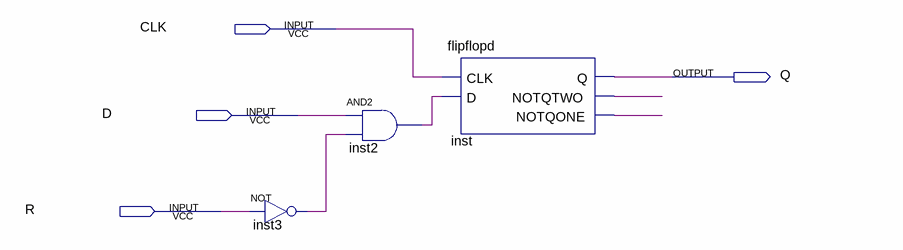
[diagram p0: schematic sheet]
// Quartus schematic resettableflipflop.bdf as structural Verilog: 3 symbols, 4 pins
module resettableflipflop (
  input  CLK,
  input  D,
  input  R,
  output Q
);

  wire inst2_out, inst3_out, inst_notqone, inst_notqtwo;

  not inst3 (inst3_out, R);
  and inst2 (inst2_out, D, inst3_out);
  flipflopd inst (.CLK(CLK), .D(inst2_out), .Q(Q), .NOTQTWO(inst_notqtwo), .NOTQONE(inst_notqone));
endmodule
